# EAGLE schematic 4093_drone_synth (EAGLE 6.2)
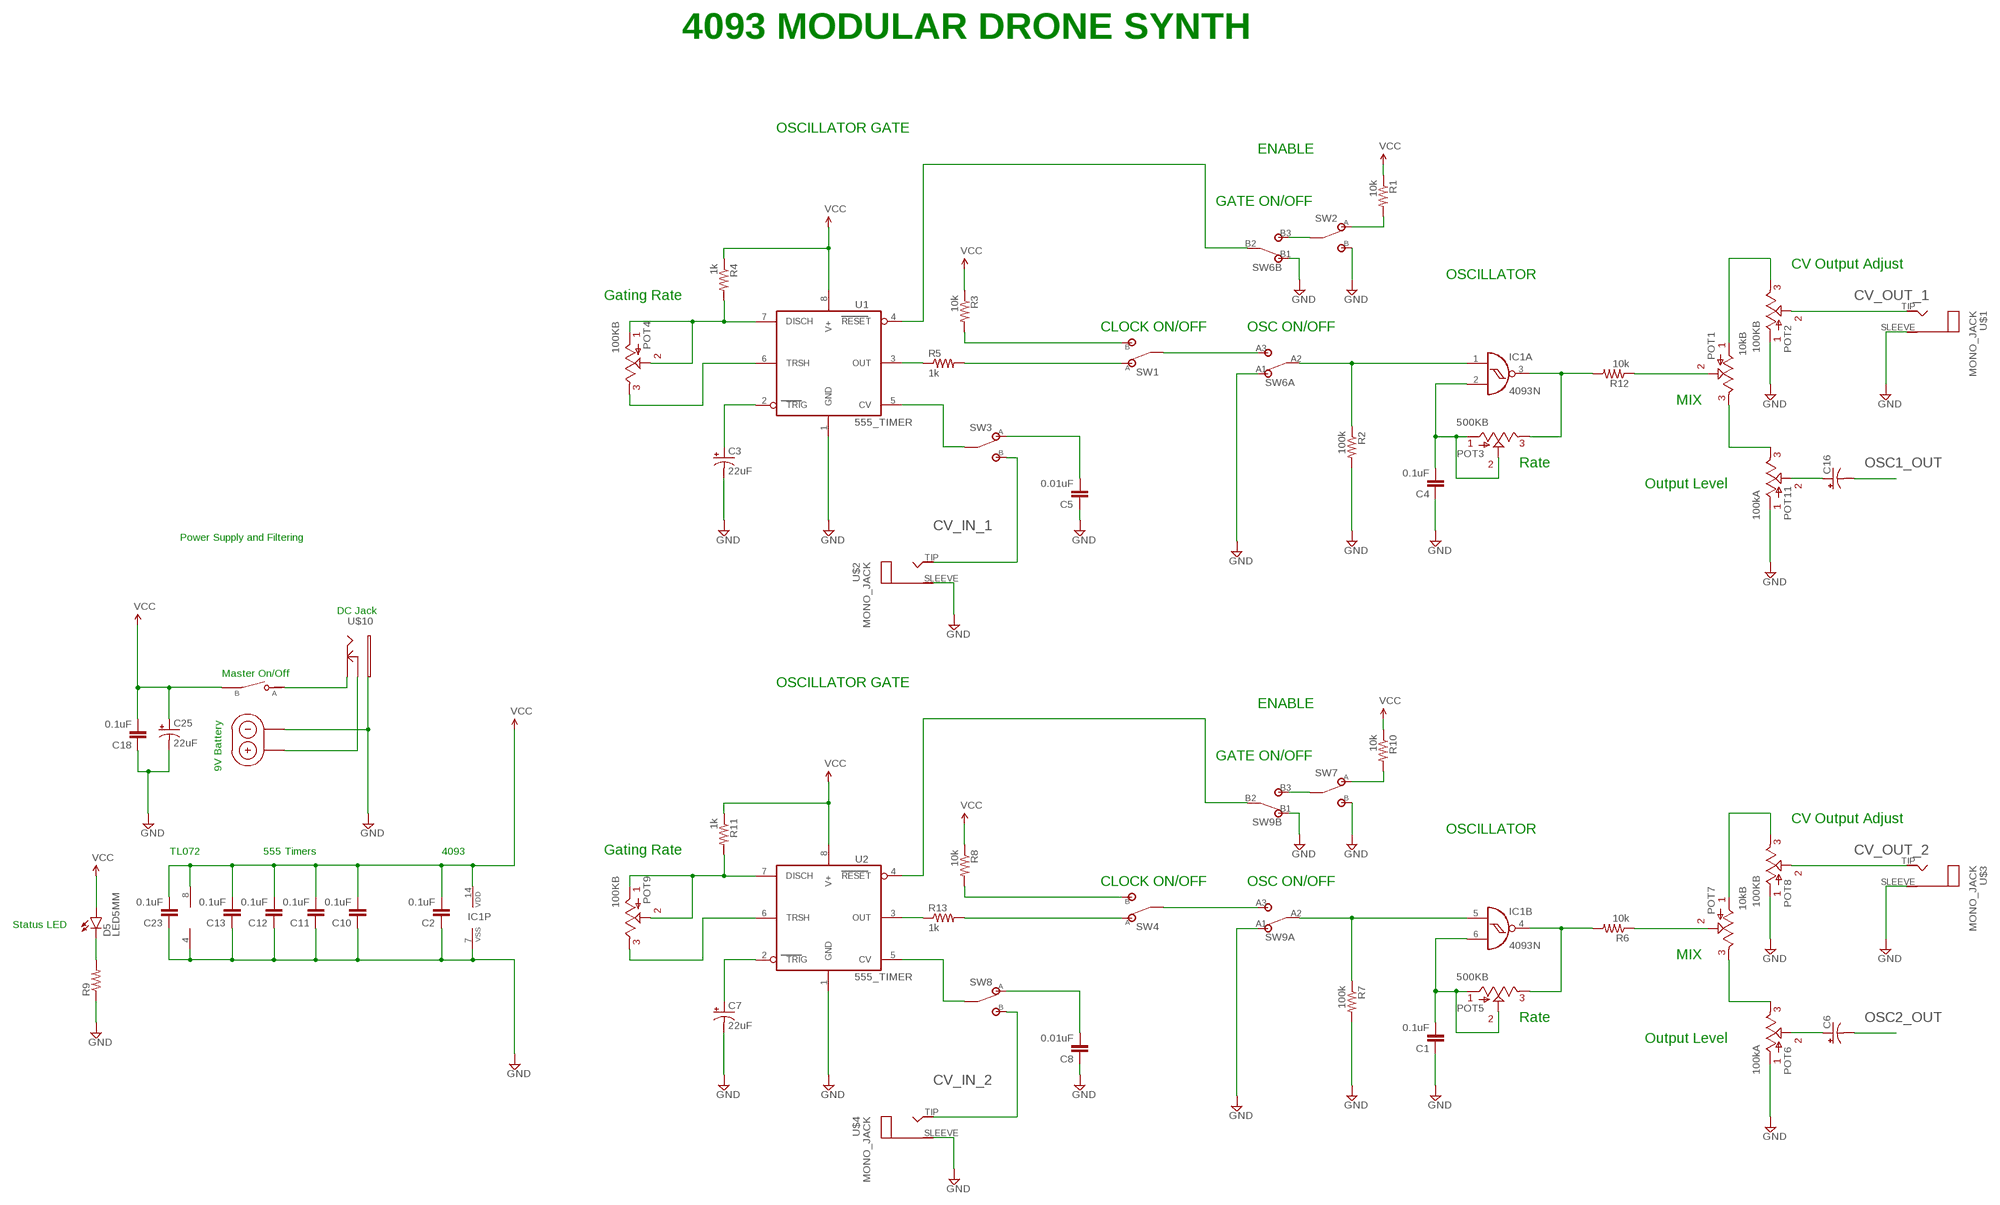
[diagram p0: schematic, sheet 1, part 1 of 3]
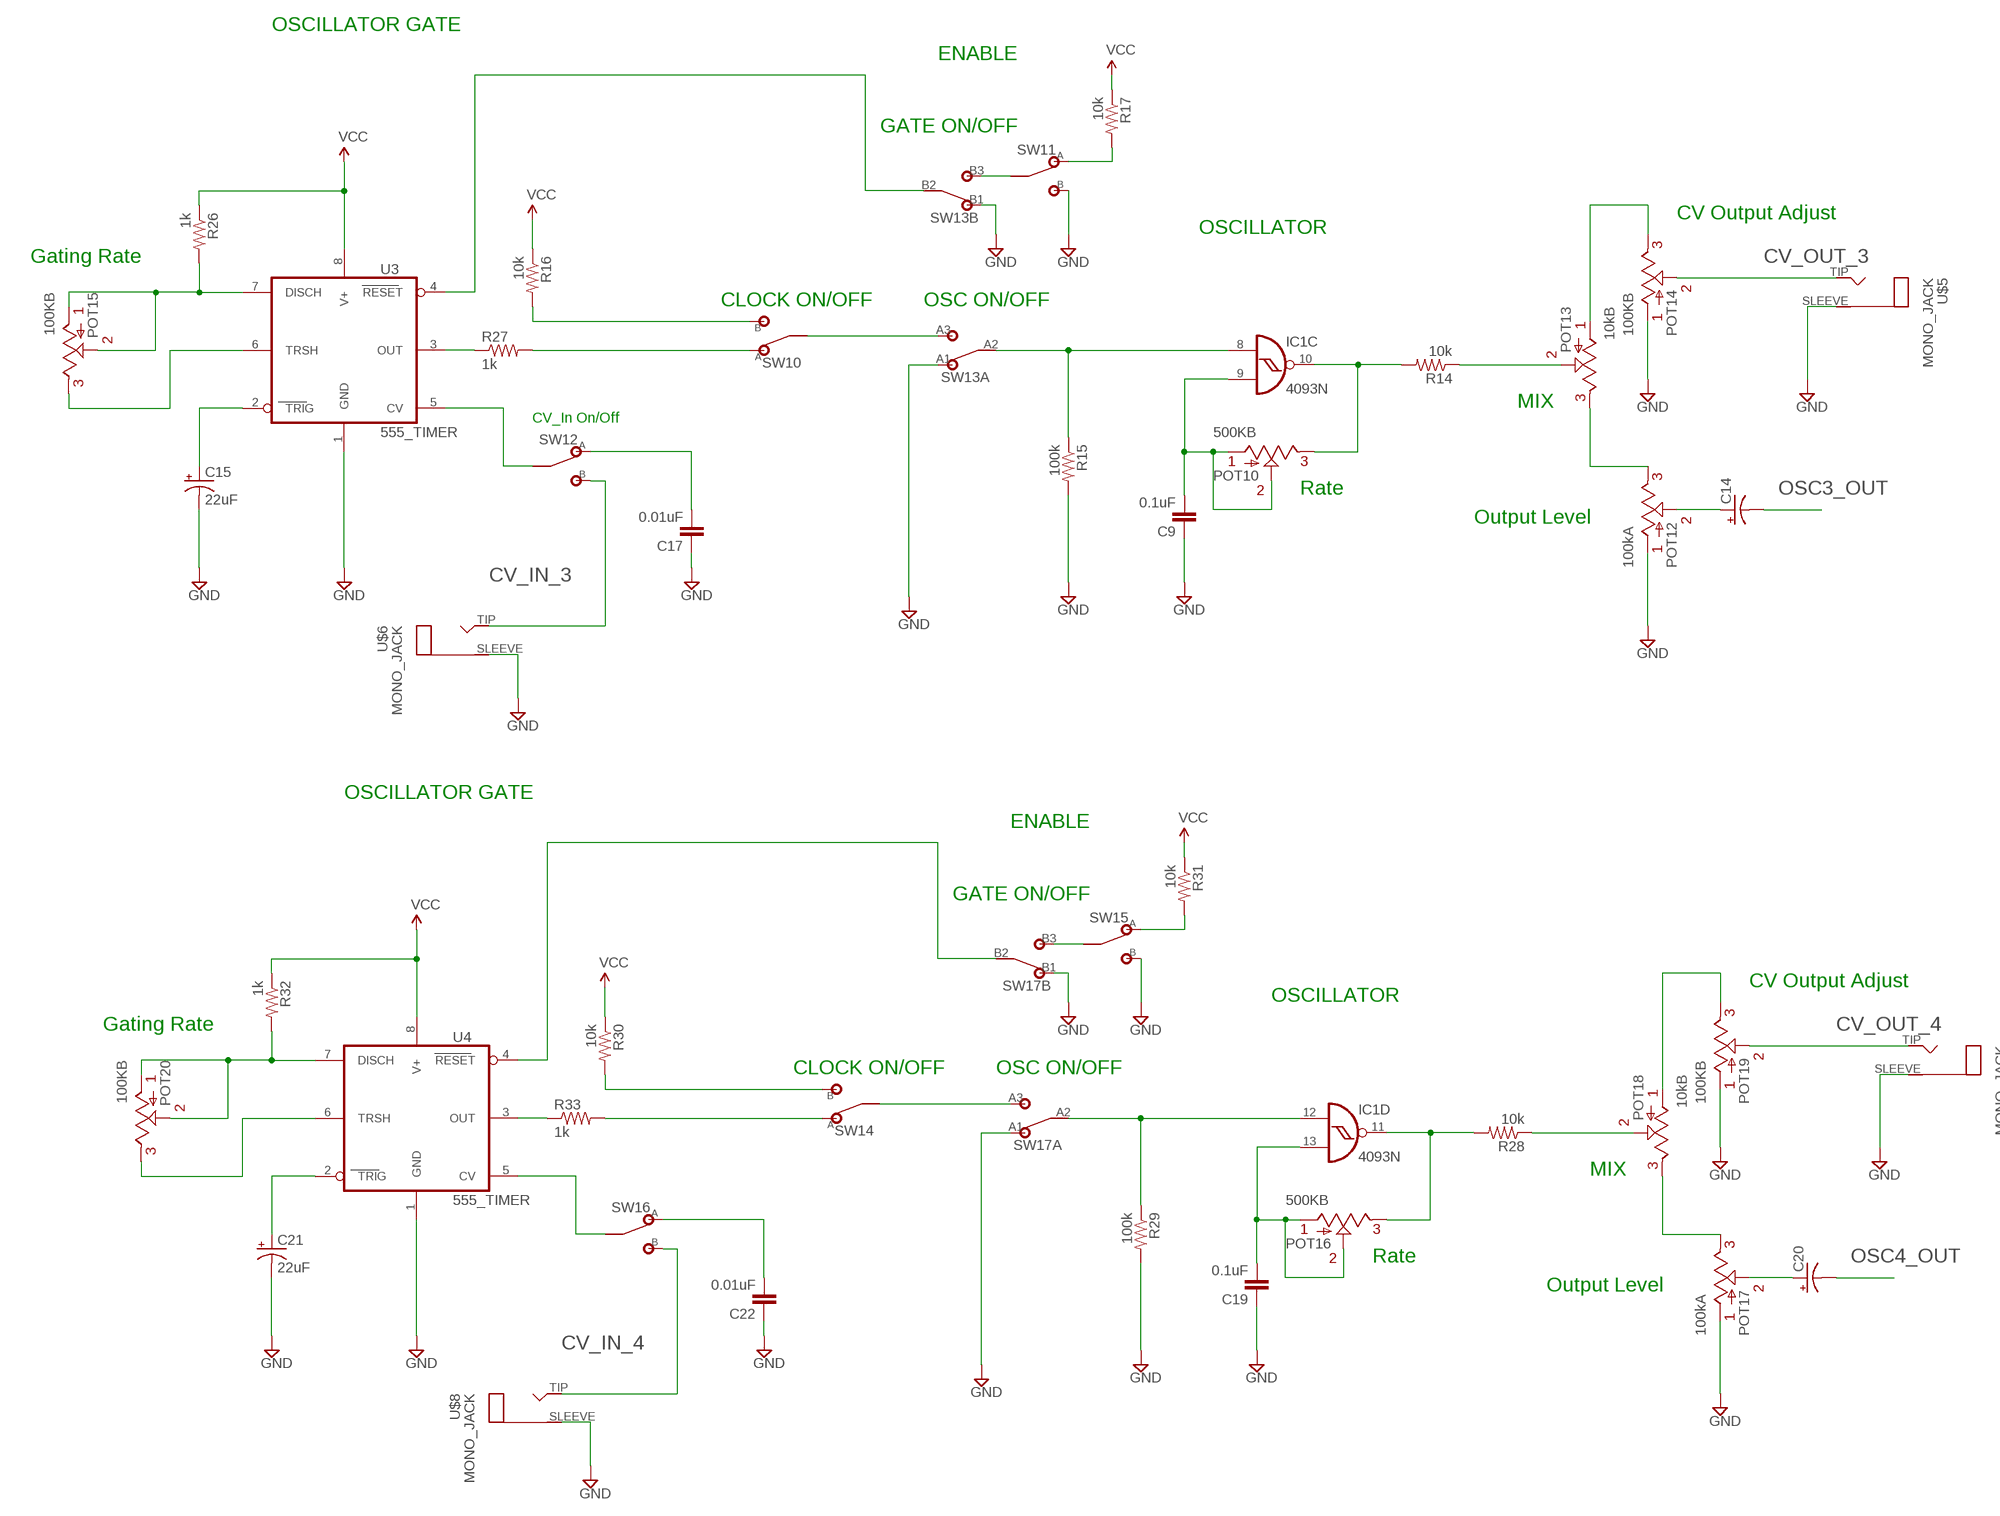
[diagram p1: schematic, sheet 1, part 2 of 3]
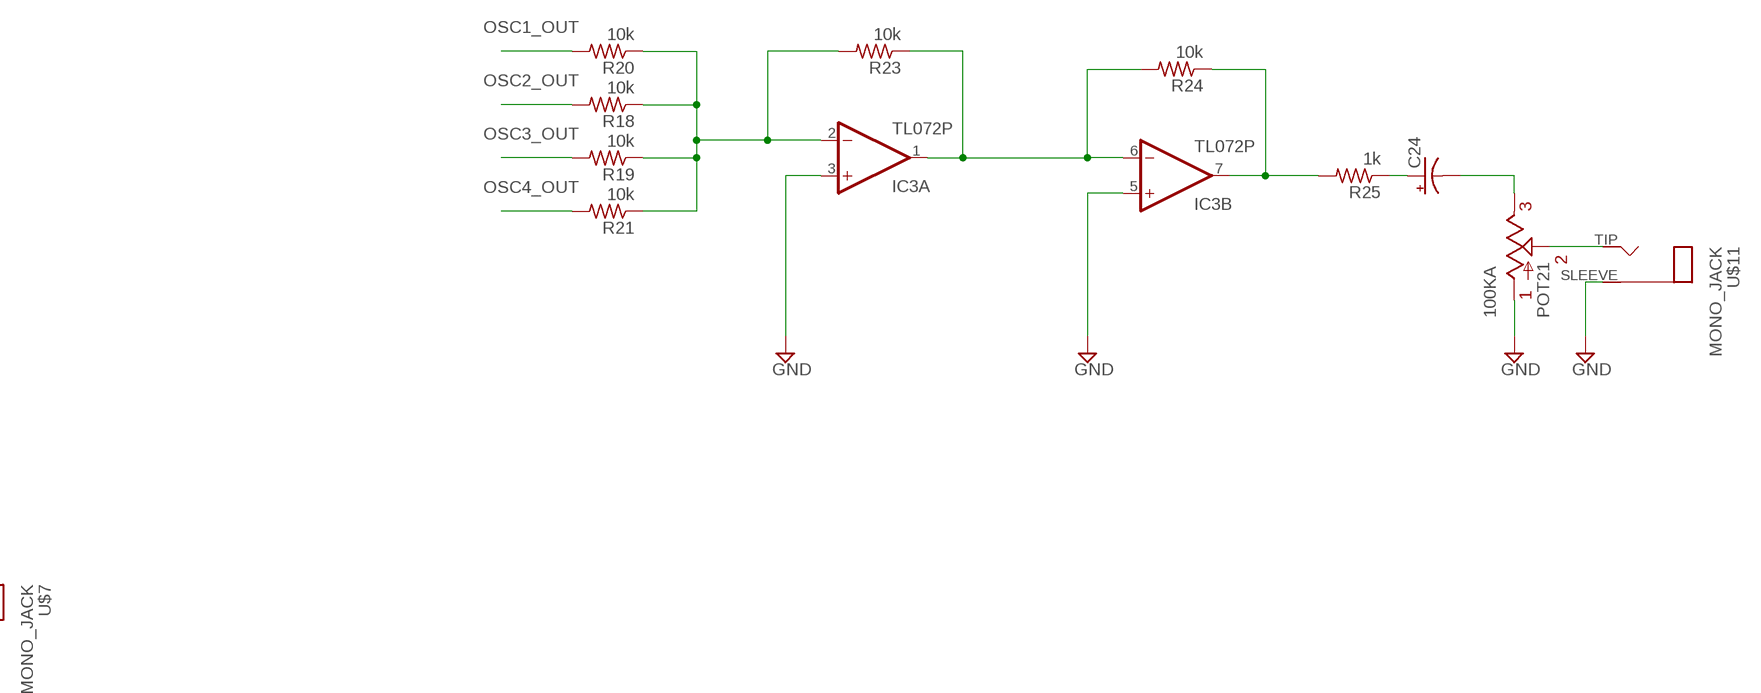
[diagram p2: schematic, sheet 1, part 3 of 3]

## Parts
C1  0.1uF  CERAMIC_CAPACITOR  [CERAMIC_CAP]
C2  0.1uF  CERAMIC_CAPACITOR  [CERAMIC_CAP]
C3  22uF  CPOL-USE5-10.5  [E5-10,5]
C4  0.1uF  CERAMIC_CAPACITOR  [CERAMIC_CAP]
C5  0.01uF  CERAMIC_CAPACITOR  [CERAMIC_CAP]
C6  CPOL-USE5-10.5  [E5-10,5]
C7  22uF  CPOL-USE5-10.5  [E5-10,5]
C8  0.01uF  CERAMIC_CAPACITOR  [CERAMIC_CAP]
C9  0.1uF  CERAMIC_CAPACITOR  [CERAMIC_CAP]
C10  0.1uF  CERAMIC_CAPACITOR  [CERAMIC_CAP]
C11  0.1uF  CERAMIC_CAPACITOR  [CERAMIC_CAP]
C12  0.1uF  CERAMIC_CAPACITOR  [CERAMIC_CAP]
C13  0.1uF  CERAMIC_CAPACITOR  [CERAMIC_CAP]
C14  CPOL-USE5-10.5  [E5-10,5]
C15  22uF  CPOL-USE5-10.5  [E5-10,5]
C16  CPOL-USE5-10.5  [E5-10,5]
C17  0.01uF  CERAMIC_CAPACITOR  [CERAMIC_CAP]
C18  0.1uF  CERAMIC_CAPACITOR  [CERAMIC_CAP]
C19  0.1uF  CERAMIC_CAPACITOR  [CERAMIC_CAP]
C20  CPOL-USE5-10.5  [E5-10,5]
C21  22uF  CPOL-USE5-10.5  [E5-10,5]
C22  0.01uF  CERAMIC_CAPACITOR  [CERAMIC_CAP]
C23  0.1uF  CERAMIC_CAPACITOR  [CERAMIC_CAP]
C24  CPOL-USE5-10.5  [E5-10,5]
C25  22uF  CPOL-USE5-10.5  [E5-10,5]
D5  LED5MM  [LED5MM]
IC1  4093N  [DIL14]
IC3  TL072P  [DIL08]
POT1  10kB  POT  [POT]
POT2  100KB  POT  [POT]
POT3  500KB  POT  [POT]
POT4  100KB  POT  [POT]
POT5  500KB  POT  [POT]
POT6  100kA  POT  [POT]
POT7  10kB  POT  [POT]
POT8  100KB  POT  [POT]
POT9  100KB  POT  [POT]
POT10  500KB  POT  [POT]
POT11  100kA  POT  [POT]
POT12  100kA  POT  [POT]
POT13  10kB  POT  [POT]
POT14  100KB  POT  [POT]
POT15  100KB  POT  [POT]
POT16  500KB  POT  [POT]
POT17  100kA  POT  [POT]
POT18  10kB  POT  [POT]
POT19  100KB  POT  [POT]
POT20  100KB  POT  [POT]
POT21  100KA  POT  [POT]
R1  10k  RESISTOR  [RESISTOR]
R2  100k  RESISTOR  [RESISTOR]
R3  10k  RESISTOR  [RESISTOR]
R4  1k  RESISTOR  [RESISTOR]
R5  1k  RESISTOR  [RESISTOR]
R6  10k  RESISTOR  [RESISTOR]
R7  100k  RESISTOR  [RESISTOR]
R8  10k  RESISTOR  [RESISTOR]
R9  RESISTOR  [RESISTOR]
R10  10k  RESISTOR  [RESISTOR]
R11  1k  RESISTOR  [RESISTOR]
R12  10k  RESISTOR  [RESISTOR]
R13  1k  RESISTOR  [RESISTOR]
R14  10k  RESISTOR  [RESISTOR]
R15  100k  RESISTOR  [RESISTOR]
R16  10k  RESISTOR  [RESISTOR]
R17  10k  RESISTOR  [RESISTOR]
R18  10k  RESISTOR  [RESISTOR]
R19  10k  RESISTOR  [RESISTOR]
R20  10k  RESISTOR  [RESISTOR]
R21  10k  RESISTOR  [RESISTOR]
R23  10k  RESISTOR  [RESISTOR]
R24  10k  RESISTOR  [RESISTOR]
R25  1k  RESISTOR  [RESISTOR]
R26  1k  RESISTOR  [RESISTOR]
R27  1k  RESISTOR  [RESISTOR]
R28  10k  RESISTOR  [RESISTOR]
R29  100k  RESISTOR  [RESISTOR]
R30  10k  RESISTOR  [RESISTOR]
R31  10k  RESISTOR  [RESISTOR]
R32  1k  RESISTOR  [RESISTOR]
R33  1k  RESISTOR  [RESISTOR]
SW1  SPDT_SWITCH  [SPDT_TOGGLE_SWITCH]
SW2  SPDT_SWITCH  [SPDT_TOGGLE_SWITCH]
SW3  SPDT_SWITCH  [SPDT_TOGGLE_SWITCH]
SW4  SPDT_SWITCH  [SPDT_TOGGLE_SWITCH]
SW6  DPDT  [DPDT]
SW7  SPDT_SWITCH  [SPDT_TOGGLE_SWITCH]
SW8  SPDT_SWITCH  [SPDT_TOGGLE_SWITCH]
SW9  DPDT  [DPDT]
SW10  SPDT_SWITCH  [SPDT_TOGGLE_SWITCH]
SW11  SPDT_SWITCH  [SPDT_TOGGLE_SWITCH]
SW12  SPDT_SWITCH  [SPDT_TOGGLE_SWITCH]
SW13  DPDT  [DPDT]
SW14  SPDT_SWITCH  [SPDT_TOGGLE_SWITCH]
SW15  SPDT_SWITCH  [SPDT_TOGGLE_SWITCH]
SW16  SPDT_SWITCH  [SPDT_TOGGLE_SWITCH]
SW17  DPDT  [DPDT]
SW18  SPST_SWITCH  [SPST_TOGGLE_SWITCH]
U1  555_TIMER  [DIL08]
U2  555_TIMER  [DIL08]
U3  555_TIMER  [DIL08]
U4  555_TIMER  [DIL08]
U$1  MONO_JACK  [MONO_JACK]
U$2  MONO_JACK  [MONO_JACK]
U$3  MONO_JACK  [MONO_JACK]
U$4  MONO_JACK  [MONO_JACK]
U$5  MONO_JACK  [MONO_JACK]
U$6  MONO_JACK  [MONO_JACK]
U$7  MONO_JACK  [MONO_JACK]
U$8  MONO_JACK  [MONO_JACK]
U$9  9V_BATTERY_CLIP  [9V_BATTERY]
U$10  DC_JACK_OFFBOARD  [DC_JACK_OFFBOARD]
U$11  MONO_JACK  [MONO_JACK]

## Nets
CV_IN_1: SW3.B U$2.TIP
CV_IN_2: SW8.B U$4.TIP
CV_IN_3: SW12.B U$6.TIP
CV_IN_4: SW16.B U$8.TIP
CV_OUT_1: POT2.2 U$1.TIP
CV_OUT_2: POT8.2 U$3.TIP
CV_OUT_3: POT14.2 U$5.TIP
CV_OUT_4: POT19.2 U$7.TIP
GND: C1.1 C2.1 C3.- C4.1 C5.1 C7.- C8.1 C9.1 C10.1 C11.1 C12.1 C13.1 C15.- C17.1 C18.1 C19.1 C21.- C22.1 C23.1 C25.- IC1.7(P:VSS) IC3.3(A:+IN) IC3.4(P:V-) IC3.5(B:+IN) POT2.1 POT6.1 POT8.1 POT11.1 POT12.1 POT14.1 POT17.1 POT19.1 POT21.1 R2.2 R7.2 R9.1 R15.2 R29.2 SW2.B SW6.A1 SW6.B1 SW7.B SW9.A1 SW9.B1 SW11.B SW13.A1 SW13.B1 SW15.B SW17.A1 SW17.B1 U1.1(GND) U2.1(GND) U3.1(GND) U4.1(GND) U$1.SLEEVE U$2.SLEEVE U$3.SLEEVE U$4.SLEEVE U$5.SLEEVE U$6.SLEEVE U$7.SLEEVE U$8.SLEEVE U$9.9V_BATTERY_- U$10.PIN U$11.SLEEVE
N$1: R1.2 SW2.A
N$2: IC1.4(B:O) POT5.3 R6.2
N$3: POT4.1 POT4.2 R4.2 U1.7(DISCH)
N$5: D5.K(C) R9.2
N$6: POT1.2 R12.1
N$7: R5.2 SW1.A
N$8: R3.2 SW1.B
N$9: R5.1 U1.3(OUT)
N$10: POT1.3 POT11.3
N$11: C1.2 IC1.6(B:I1) POT5.1 POT5.2
N$12: POT1.1 POT2.3
N$13: C3.+ U1.2(TRIG)
N$14: IC1.3(A:O) POT3.3 R12.2
N$15: C4.2 IC1.2(A:I1) POT3.1 POT3.2
N$16: IC1.1(A:I0) R2.1 SW6.A2
N$17: POT4.3 U1.6(TRSH)
N$18: SW3.C(COM) U1.5(CV)
N$19: C5.2 SW3.A
N$20: SW6.B2 U1.4(RESET)
N$21: SW1.C(COM) SW6.A3
N$22: SW2.C(COM) SW6.B3
N$23: IC1.5(B:I0) R7.1 SW9.A2
N$24: C6.+ POT6.2
N$25: R8.2 SW4.B
N$26: POT9.1 POT9.2 R11.2 U2.7(DISCH)
N$27: R13.2 SW4.A
N$28: R13.1 U2.3(OUT)
N$29: POT7.2 R6.1
N$30: POT6.3 POT7.3
N$31: POT7.1 POT8.3
N$32: C7.+ U2.2(TRIG)
N$33: POT9.3 U2.6(TRSH)
N$34: SW8.C(COM) U2.5(CV)
N$35: C8.2 SW8.A
N$36: SW4.C(COM) SW9.A3
N$37: SW9.B2 U2.4(RESET)
N$38: SW7.C(COM) SW9.B3
N$39: R10.2 SW7.A
N$40: C16.+ POT11.2
N$41: IC1.10(C:O) POT10.3 R14.2
N$42: C9.2 IC1.9(C:I1) POT10.1 POT10.2
N$43: IC1.8(C:I0) R15.1 SW13.A2
N$44: C14.+ POT12.2
N$45: R16.2 SW10.B
N$46: POT15.1 POT15.2 R26.2 U3.7(DISCH)
N$47: R27.2 SW10.A
N$48: R27.1 U3.3(OUT)
N$49: POT13.2 R14.1
N$50: POT12.3 POT13.3
N$51: POT13.1 POT14.3
N$52: C15.+ U3.2(TRIG)
N$53: POT15.3 U3.6(TRSH)
N$54: SW12.C(COM) U3.5(CV)
N$55: C17.2 SW12.A
N$56: SW10.C(COM) SW13.A3
N$57: SW13.B2 U3.4(RESET)
N$58: SW11.C(COM) SW13.B3
N$59: R17.2 SW11.A
N$60: IC1.11(D:O) POT16.3 R28.2
N$61: C19.2 IC1.13(D:I1) POT16.1 POT16.2
N$62: U$9.9V_BATTERY_+ U$10.CONNECT
N$63: SW18.A U$10.SLEEVE
N$65: POT21.2 U$11.TIP
N$66: IC3.2(A:-IN) R18.1 R19.1 R20.1 R21.1 R23.2
N$67: IC1.12(D:I0) R29.1 SW17.A2
N$68: C20.+ POT17.2
N$69: IC3.1(A:OUT) IC3.6(B:-IN) R23.1 R24.2
N$71: IC3.7(B:OUT) R24.1 R25.2
N$72: R30.2 SW14.B
N$73: POT20.1 POT20.2 R32.2 U4.7(DISCH)
N$74: C24.+ R25.1
N$75: C24.- POT21.3
N$76: R33.2 SW14.A
N$77: R33.1 U4.3(OUT)
N$78: POT18.2 R28.1
N$79: POT17.3 POT18.3
N$80: POT18.1 POT19.3
N$81: C21.+ U4.2(TRIG)
N$82: POT20.3 U4.6(TRSH)
N$83: SW16.C(COM) U4.5(CV)
N$84: C22.2 SW16.A
N$85: SW14.C(COM) SW17.A3
N$86: SW17.B2 U4.4(RESET)
N$87: SW15.C(COM) SW17.B3
N$88: R31.2 SW15.A
OSC1_OUT: C16.- R20.2
OSC2_OUT: C6.- R18.2
OSC3_OUT: C14.- R19.2
OSC4_OUT: C20.- R21.2
VCC: C2.2 C10.2 C11.2 C12.2 C13.2 C18.2 C23.2 C25.+ D5.A IC1.14(P:VDD) IC3.8(P:V+) R1.1 R3.1 R4.1 R8.1 R10.1 R11.1 R16.1 R17.1 R26.1 R30.1 R31.1 R32.1 SW18.B U1.8(V+) U2.8(V+) U3.8(V+) U4.8(V+)

## Notes on the sheet
- 4093 MODULAR DRONE SYNTH
- OSCILLATOR GATE
- ENABLE | OSCILLATOR GATE
- ENABLE
- GATE ON/OFF
- GATE ON/OFF
- CV Output Adjust
- OSCILLATOR
- Gating Rate | CV Output Adjust
- OSCILLATOR
- Gating Rate
- CLOCK ON/OFF | OSC ON/OFF
- CLOCK ON/OFF | OSC ON/OFF
- MIX
- MIX
- CV_In On/Off
- Rate
- Output Level | Rate
- Output Level
- Power Supply and Filtering
- DC Jack
- Master On/Off
- OSCILLATOR GATE
- ENABLE | OSCILLATOR GATE
- ENABLE
- GATE ON/OFF
- 9V Battery
- GATE ON/OFF
- CV Output Adjust
- OSCILLATOR
- Gating Rate | CV Output Adjust
- TL072 | 555 Timers | 4093 | OSCILLATOR
- Gating Rate
- CLOCK ON/OFF | OSC ON/OFF
- CLOCK ON/OFF | OSC ON/OFF
- Status LED
- MIX
- MIX
- Rate
- Output Level | Rate
- Output Level

## Library data of the parts
C1 C2 C4 C5 C8-C13 C17-C19 C22 C23 = 00_steve:CERAMIC_CAPACITOR
C3 C6 C7 C14-C16 C20 C21 C24 C25 = rcl:CPOL-US: POLARIZED CAPACITOR, American symbol
D5 = gm-diodes:LED
IC1 = 40xx:4093: Quad 2-input NAND schmitt trigger
IC3 = gm-ics:TL072: OP AMP
POT1-POT21 = 00_steve:POT
R1-R21 R23-R33 = 00_steve:RESISTOR
SW1-SW4 SW7 SW8 SW10-SW12 SW14-SW16 = 00_steve:SPDT_SWITCH: SPDT Switch Part No.: M102 Source: (http://www.led-switch.com)
SW6 SW9 SW13 SW17 = gm-switches:DPDT
SW18 = 00_steve:SPST_SWITCH: SPST Switch Part No.: M101 Source: (http://www.led-switch.com)
U1-U4 = 00_steve:555_TIMER
U$1-U$8 U$11 = 00_steve:MONO_JACK
U$9 = 00_steve:9V_BATTERY_CLIP
U$10 = 00_steve:DC_JACK_OFFBOARD